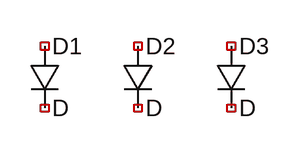
[diagram p0: schematic lt spice.asc]
lt spice.asc, the LTspice schematic file:
Version 4
SHEET 1 880 680
SYMBOL diode 144 64 R0
SYMATTR InstName D1
SYMBOL diode 240 64 R0
SYMATTR InstName D2
SYMBOL diode 336 64 R0
SYMATTR InstName D3

The netlist it stands for:
* lt spice.asc
D1 NC_01 NC_02 D
D2 NC_03 NC_04 D
D3 NC_05 NC_06 D
.model D D
.lib standard.dio
.backanno
.end